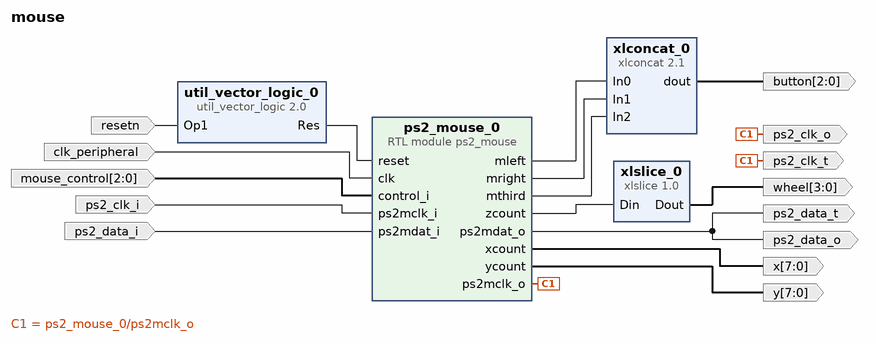
[diagram p0: block diagram of the top level]
# Vivado block design mouse, xc7a100tcsg324-1, Vivado 2021.2.1
create_bd_design mouse

create_bd_port -dir O -from 2 -to 0 button
create_bd_port -dir I -type clk clk_peripheral
set_property -dict {CONFIG.FREQ_HZ 28000000} [get_bd_ports clk_peripheral]
create_bd_port -dir I -from 2 -to 0 mouse_control
create_bd_port -dir I ps2_clk_i
create_bd_port -dir O ps2_clk_o
create_bd_port -dir O ps2_clk_t
create_bd_port -dir I ps2_data_i
create_bd_port -dir O ps2_data_o
create_bd_port -dir O ps2_data_t
create_bd_port -dir O -from 3 -to 0 wheel
create_bd_port -dir O -from 7 -to 0 x
create_bd_port -dir O -from 7 -to 0 y
create_bd_port -dir I -type rst resetn

create_bd_cell -type module -reference ps2_mouse ps2_mouse_0
create_bd_cell -type ip -vlnv xilinx.com:ip:xlconcat:2.1 xlconcat_0
set_property -dict {CONFIG.NUM_PORTS 3} [get_bd_cells xlconcat_0]
create_bd_cell -type ip -vlnv xilinx.com:ip:xlslice:1.0 xlslice_0
set_property -dict {CONFIG.DIN_FROM 3 CONFIG.DIN_WIDTH 8 CONFIG.DOUT_WIDTH 4} [get_bd_cells xlslice_0]
create_bd_cell -type ip -vlnv xilinx.com:ip:util_vector_logic:2.0 util_vector_logic_0
set_property -dict {CONFIG.C_OPERATION not CONFIG.C_SIZE 1} [get_bd_cells util_vector_logic_0]

# ---- connections ----

connect_bd_net [get_bd_ports clk_peripheral] [get_bd_pins ps2_mouse_0/clk]
connect_bd_net -net control_1 [get_bd_ports mouse_control] [get_bd_pins ps2_mouse_0/control_i]
connect_bd_net [get_bd_ports ps2_clk_i] [get_bd_pins ps2_mouse_0/ps2mclk_i]
connect_bd_net [get_bd_ports ps2_data_i] [get_bd_pins ps2_mouse_0/ps2mdat_i]
connect_bd_net [get_bd_pins ps2_mouse_0/mleft] [get_bd_pins xlconcat_0/In0]
connect_bd_net [get_bd_pins ps2_mouse_0/mright] [get_bd_pins xlconcat_0/In1]
connect_bd_net [get_bd_pins ps2_mouse_0/mthird] [get_bd_pins xlconcat_0/In2]
connect_bd_net [get_bd_pins ps2_mouse_0/ps2mclk_o] [get_bd_ports ps2_clk_o] [get_bd_ports ps2_clk_t]
connect_bd_net [get_bd_pins ps2_mouse_0/ps2mdat_o] [get_bd_ports ps2_data_o] [get_bd_ports ps2_data_t]
connect_bd_net [get_bd_pins ps2_mouse_0/xcount] [get_bd_ports x]
connect_bd_net [get_bd_pins ps2_mouse_0/ycount] [get_bd_ports y]
connect_bd_net [get_bd_pins ps2_mouse_0/zcount] [get_bd_pins xlslice_0/Din]
connect_bd_net [get_bd_ports resetn] [get_bd_pins util_vector_logic_0/Op1]
connect_bd_net [get_bd_pins util_vector_logic_0/Res] [get_bd_pins ps2_mouse_0/reset]
connect_bd_net [get_bd_pins xlconcat_0/dout] [get_bd_ports button]
connect_bd_net [get_bd_pins xlslice_0/Dout] [get_bd_ports wheel]

validate_bd_design
save_bd_design
